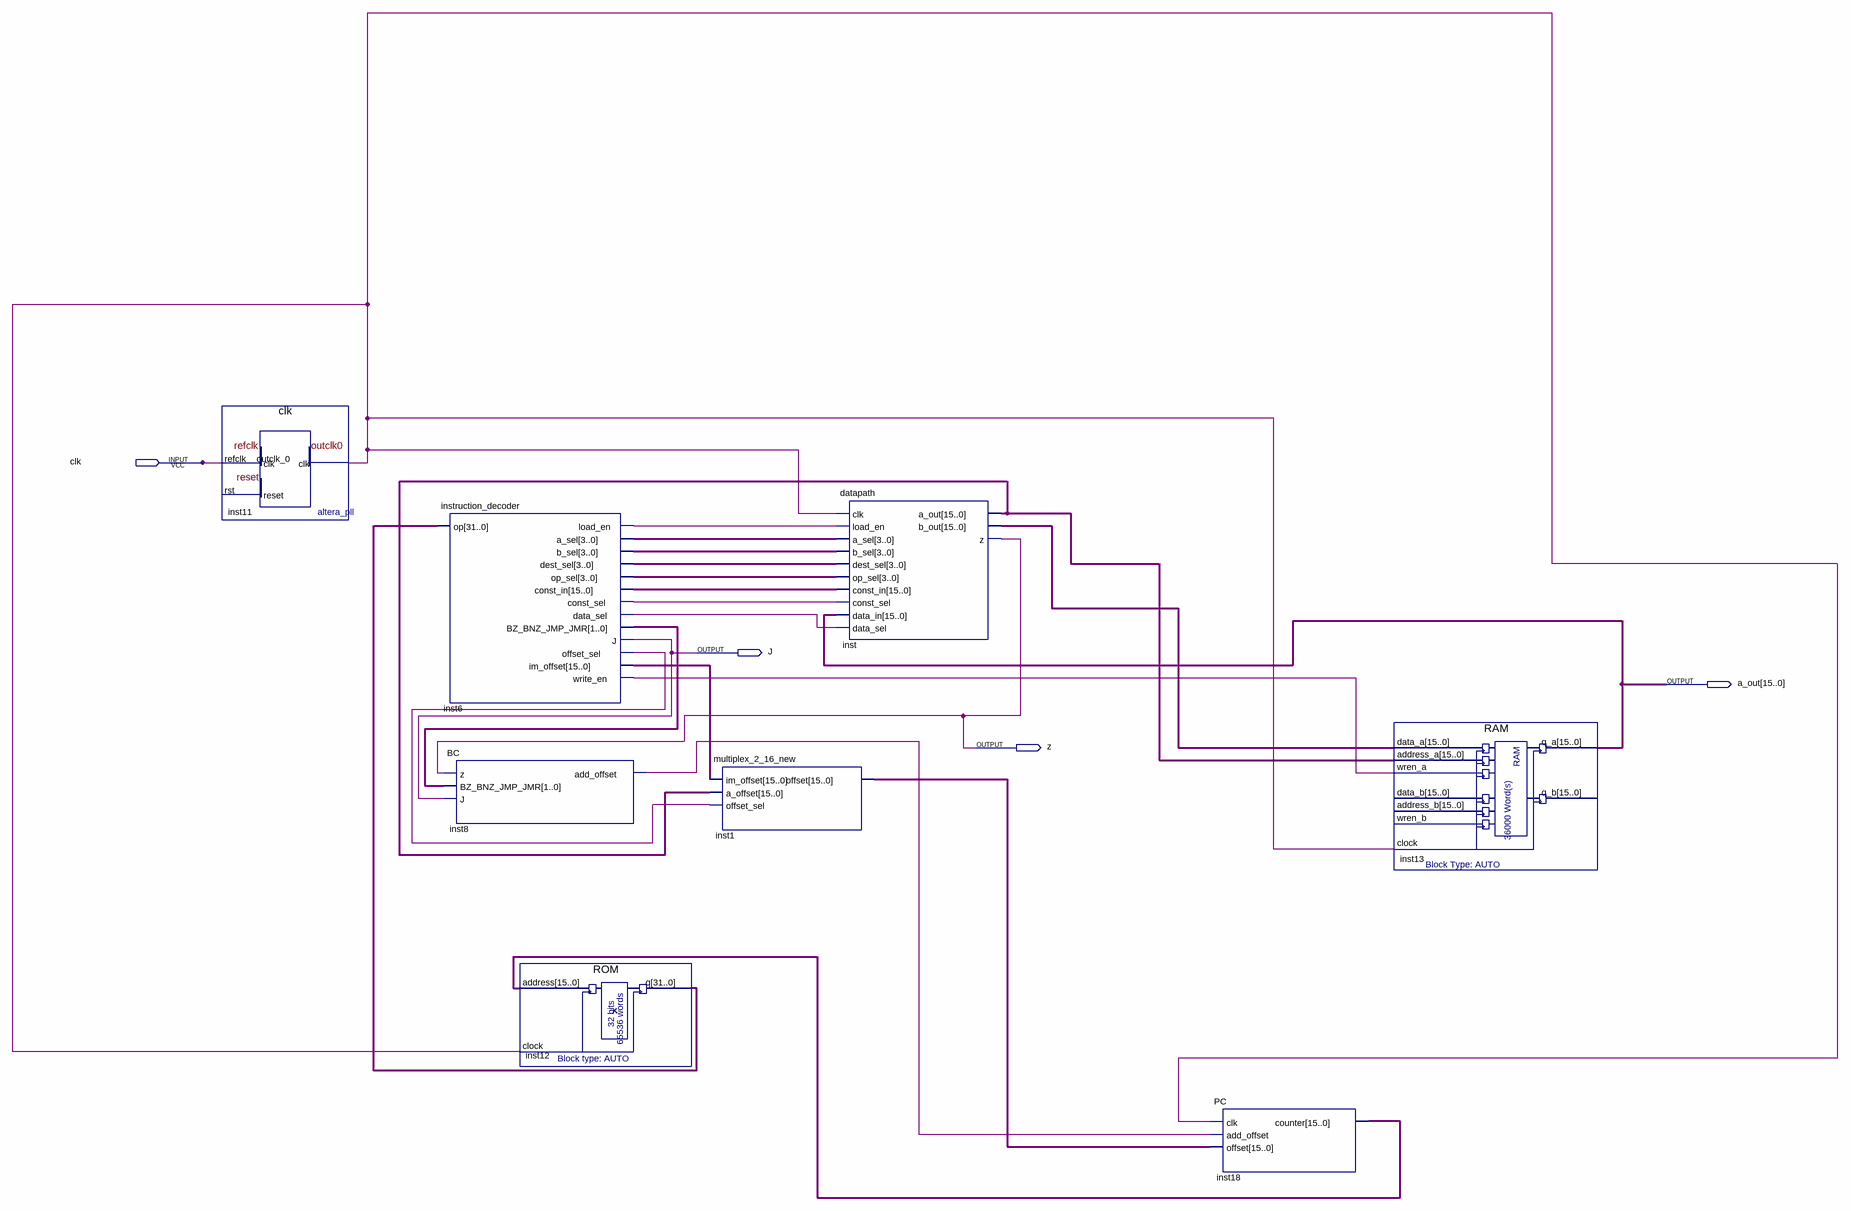
[diagram p0: schematic sheet]
// Quartus schematic MB.bdf as structural Verilog: 8 symbols, 4 pins
module MB (
  input  clk,
  output J,
  output [15:0] a_out,
  output z
);

  wire inst6_const_sel, inst6_data_sel, inst6_load_en, inst6_offset_sel, inst6_write_en, inst8_add_offset,
       inst11_outclk_0;
  wire [1:0] inst6_bz_bnz_jmp_jmr;
  wire [3:0] inst6_a_sel, inst6_b_sel, inst6_dest_sel, inst6_op_sel;
  wire [15:0] inst1_offset, inst6_const_in, inst6_im_offset, inst18_counter, inst_a_out, inst_b_out;
  wire [31:0] inst12_q;

  clk inst11 (.refclk(clk), .outclk_0(inst11_outclk_0));  // open: rst
  instruction_decoder inst6 (
    .op(inst12_q), .load_en(inst6_load_en), .a_sel(inst6_a_sel), .b_sel(inst6_b_sel),
    .dest_sel(inst6_dest_sel), .op_sel(inst6_op_sel), .const_in(inst6_const_in), .const_sel(inst6_const_sel),
    .data_sel(inst6_data_sel), .BZ_BNZ_JMP_JMR(inst6_bz_bnz_jmp_jmr), .J(J), .offset_sel(inst6_offset_sel),
    .im_offset(inst6_im_offset), .write_en(inst6_write_en));
  BC inst8 (.z(z), .BZ_BNZ_JMP_JMR(inst6_bz_bnz_jmp_jmr), .J(J), .add_offset(inst8_add_offset));
  ROM inst12 (.address(inst18_counter), .clock(inst11_outclk_0), .q(inst12_q));
  multiplex_2_16_new inst1 (
    .im_offset(inst6_im_offset), .a_offset(inst_a_out), .offset_sel(inst6_offset_sel), .offset(inst1_offset));
  datapath inst (
    .clk(inst11_outclk_0), .load_en(inst6_load_en), .a_sel(inst6_a_sel), .b_sel(inst6_b_sel),
    .dest_sel(inst6_dest_sel), .op_sel(inst6_op_sel), .const_in(inst6_const_in), .const_sel(inst6_const_sel),
    .data_in(a_out), .data_sel(inst6_data_sel), .a_out(inst_a_out), .b_out(inst_b_out), .z(z));
  PC inst18 (.clk(inst11_outclk_0), .add_offset(inst8_add_offset), .offset(inst1_offset), .counter(inst18_counter));
  RAM inst13 (
    .data_a(inst_b_out), .address_a(inst_a_out), .wren_a(inst6_write_en), .clock(inst11_outclk_0), .q_a(a_out));  // open: data_b, address_b, wren_b, q_b
endmodule
